# Altium schematic sheet PowerSupply.SchDoc
size A4
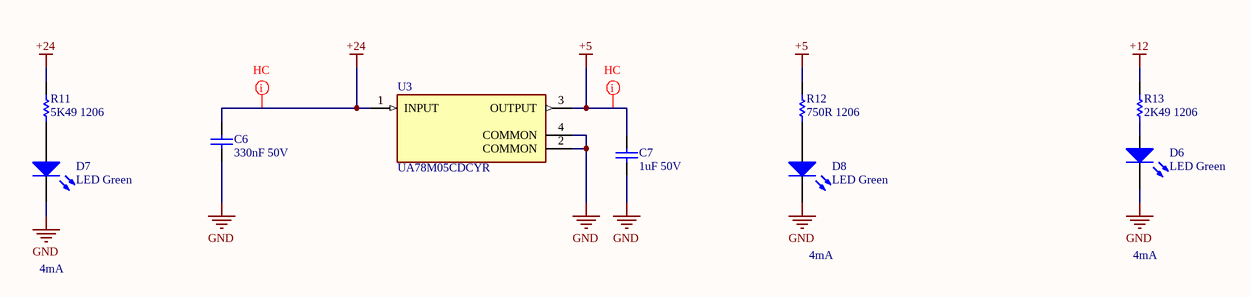
[diagram p0: PowerSupply.SchDoc]

## Parts
C6  330nF 50V  [CAPC0603(1608)100_L]
C7  1uF 50V  [CAPC0603(1608)100_L]
D6  LED Green  [0603_A]
D7  LED Green  [0603_A]
D8  LED Green  [0603_A]
R11  5K49 1206  [R-1206]
R12  750R 1206  [R-1206]
R13  2K49 1206  [R-1206]
U3  UA78M05CDCYR  [FP-DCY0004A-MFG]

## Nets
+5: C7.1 R12.2 U3.3(OUTPUT)
+12: R13.2
+24: C6.2 R11.2 U3.1(INPUT)
GND: C6.1 C7.2 D6.1(K) D7.1(K) D8.1(K) U3.2(COMMON) U3.4(COMMON)
NetD6_2: D6.2(A) R13.1
NetD7_2: D7.2(A) R11.1
NetD8_2: D8.2(A) R12.1

## Layout directives
net class HC: +5, +24

## Notes on the sheet
- 4mA

## Library data of the parts
C6 = CMP-1035-02677-1: CAP 330nF 35V ±10% 0603 (1608 Metric) Thickness 1mm SMD; Case-EIA: 0603; Case-Metric: 1608; Tolerance: Â±10%; Technology: SMT; Max Thickness: 1 mm; Value: 330nF; Rated Voltage: 35 V
C7 = CMP-1035-02743-1: CAP 1uF 35V ±10% 0603 (1608 Metric) Thickness 1mm SMD; Case-Metric: 1608; Case-EIA: 0603; Tolerance: Â±10%; Max Thickness: 1 mm; Value: 1uF; Technology: SMT; Rated Voltage: 35 V
D6-D8 = CMP-1426-00002-1: SMD mono-color Chip LED, WL-SMCW, Green; PartNumber: 150060GS75000; Manufacturer: Wuerth Elektronik; ComponentLink1URL: http://www.we-online.com; ComponentLink2Description: Datasheet; Color: Green; ComponentLink2URL: http://katalog.we-online.com/led/datasheet/150060GS75000.pdf; PackageReference: 0603_A; ComponentLink1Description: Manufacturer URL
R11-R13 = R-1206: 0.25W 1206; Power: 0.1 W; Value: 10000.00 Ohm; Tolerance: 1 %; Case-EIA: 0603; Case-Metric: 1608; Technology: SMT
U3 = CMP-04917-000015-1: IC REG LINEAR 5V 500MA SOT223-4; Manufacturer: Texas Instruments; Accuracy Percentage: 3%; Dropout Voltage: 2V; Max Supply Voltage: 25V; Min Supply Voltage: 7V; Nominal Supply Current: 4.5mA; Max Junction Temp: +125°C; Number Of Outputs: 1; Output Type: Fixed; Standoff Height: 0.02mm; Automotive: No; ComponentLink2URL: http://www.ti.com/lit/ds/symlink/ua78m.pdf; ComponentLink2Description: Datasheet; Category: IC; Output Voltage: 5V; Lead Free: Yes; Height: 1.8mm; Temperature Range Low: 0°C; Octopart: https://octopart.com/ua78m05cdcyr-texas+instruments-525243; Device Class L3: Voltage Regulators - Linear; Mouser Description: Linear Voltage Regulators 5.0V 500mA Fxd Pos; Device Class L1: Integrated Circuits (ICs); RoHS: TRUE; Output Current: 500mA; Temperature Range High: +125°C; Manufacturer Part Number: UA78M05CDCYR; Device Class L2: Power Management ICs; Digikey Description: IC REG LINEAR 5V 500MA SOT223-4; Package: DCY0004A; Temperature: 0°C to +125°C